# EAGLE schematic Lafferty1ab (EAGLE 6.6.0), part 1 of 2

## Sheet 1 of 5
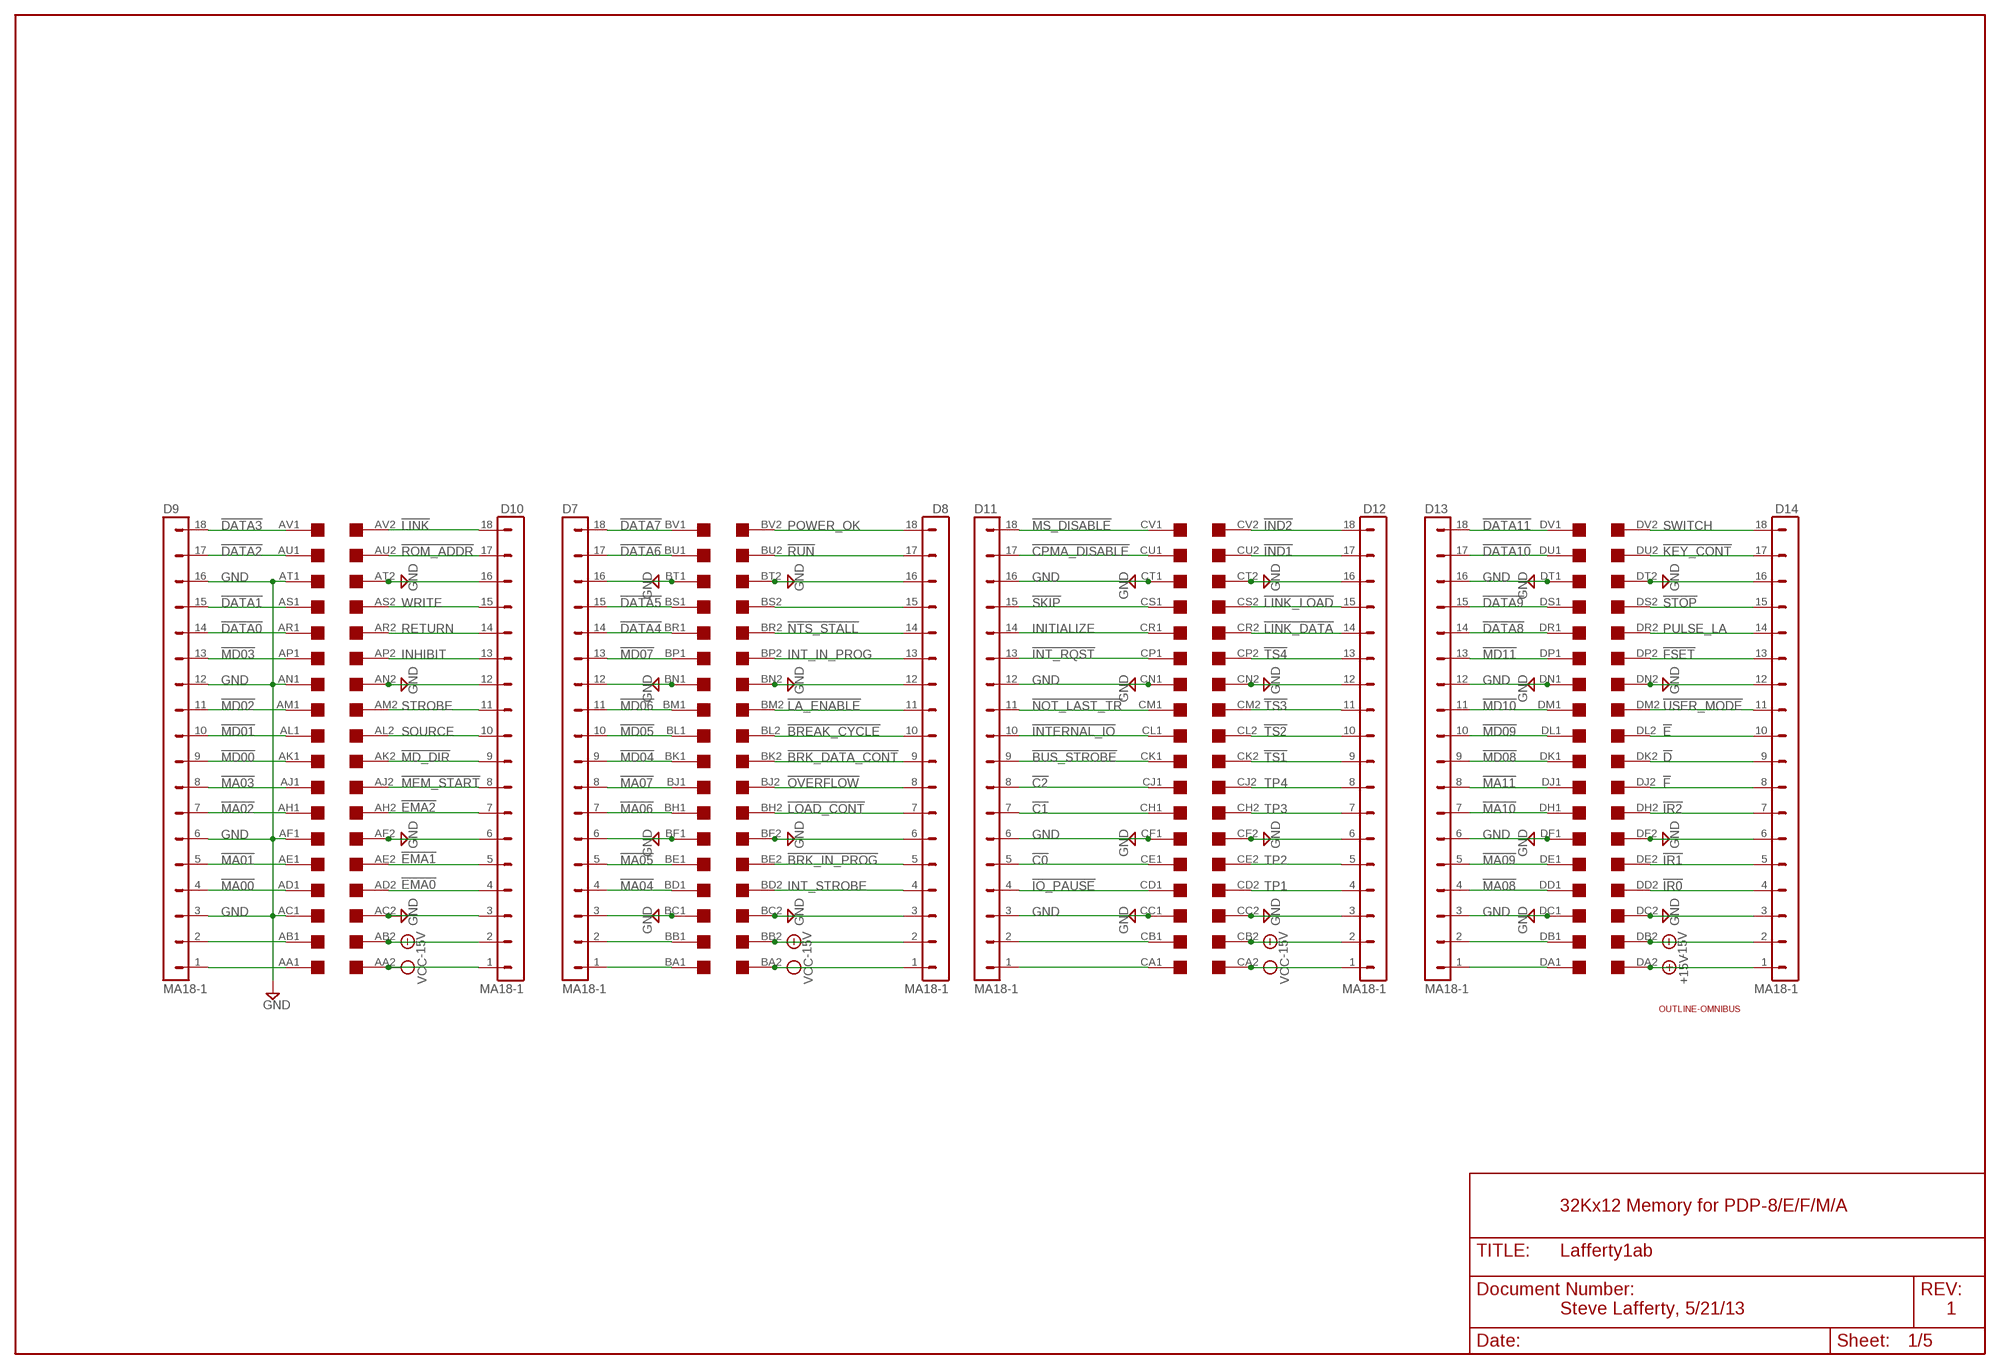
[diagram p0: schematic, sheet 1]

### Parts
D7  MA18-1  [MA18-1]
D8  MA18-1  [MA18-1]
D9  MA18-1  [MA18-1]
D10  MA18-1  [MA18-1]
D11  MA18-1  [MA18-1]
D12  MA18-1  [MA18-1]
D13  MA18-1  [MA18-1]
D14  MA18-1  [MA18-1]
U$1  OUTLINE-OMNIBUS  [OMNIBUS]
U$2  QUAD  [EDGE-CON8]

### Nets
!BREAK_CYCLE: D8.10 U$2.BL2
!BRK_DATA_CONT: D8.9 U$2.BK2
!BRK_IN_PROG: D8.5 U$2.BE2
!BUS_STROBE: D11.9 U$2.CK1
!C0: D11.5 U$2.CE1
!C1: D11.7 U$2.CH1
!C2: D11.8 U$2.CJ1
!CPMA_DISABLE: D11.17 U$2.CU1
!D: D14.9 U$2.DK2
!DATA0: D9.14 U$2.AR1
!DATA1: D9.15 U$2.AS1
!DATA2: D9.17 U$2.AU1
!DATA3: D9.18 U$2.AV1
!DATA4: D7.14 U$2.BR1
!DATA5: D7.15 U$2.BS1
!DATA6: D7.17 U$2.BU1
!DATA7: D7.18 U$2.BV1
!DATA8: D13.14 U$2.DR1
!DATA9: D13.15 U$2.DS1
!DATA10: D13.17 U$2.DU1
!DATA11: D13.18 U$2.DV1
!E: D14.10 U$2.DL2
!EMA0: D10.4 U$2.AD2 ; also sheet 2
!EMA1: D10.5 U$2.AE2 ; also sheet 2
!EMA2: D10.7 U$2.AH2 ; also sheet 2
!F: D14.8 U$2.DJ2
!FSET: D14.13 U$2.DP2
!IND1: D12.17 U$2.CU2
!IND2: D12.18 U$2.CV2
!INT_RQST: D11.13 U$2.CP1
!INTERNAL_IO: D11.10 U$2.CL1
!IO_PAUSE: D11.4 U$2.CD1
!IR0: D14.4 U$2.DD2
!IR1: D14.5 U$2.DE2
!IR2: D14.7 U$2.DH2
!KEY_CONT: D14.17 U$2.DU2
!LA_ENABLE: D8.11 U$2.BM2
!LINK: D10.18 U$2.AV2
!LINK_DATA: D12.14 U$2.CR2
!LINK_LOAD: D12.15 U$2.CS2
!LOAD_CONT: D8.7 U$2.BH2
!MA00: D9.4 U$2.AD1 ; also sheet 2
!MA01: D9.5 U$2.AE1 ; also sheet 2
!MA02: D9.7 U$2.AH1 ; also sheet 2
!MA03: D9.8 U$2.AJ1 ; also sheet 2
!MA04: D7.4 U$2.BD1 ; also sheet 2
!MA05: D7.5 U$2.BE1 ; also sheet 2
!MA06: D7.7 U$2.BH1 ; also sheet 2
!MA07: D7.8 U$2.BJ1 ; also sheet 2
!MA08: D13.4 U$2.DD1 ; also sheet 2
!MA09: D13.5 U$2.DE1 ; also sheet 2
!MA10: D13.7 U$2.DH1 ; also sheet 2
!MA11: D13.8 U$2.DJ1 ; also sheet 2
!MD00: D9.9 U$2.AK1 ; also sheet 2
!MD01: D9.10 U$2.AL1 ; also sheet 2
!MD02: D9.11 U$2.AM1 ; also sheet 2
!MD03: D9.13 U$2.AP1 ; also sheet 2
!MD04: D7.9 U$2.BK1 ; also sheet 2
!MD05: D7.10 U$2.BL1 ; also sheet 2
!MD06: D7.11 U$2.BM1 ; also sheet 2
!MD07: D7.13 U$2.BP1 ; also sheet 2
!MD08: D13.9 U$2.DK1 ; also sheet 2
!MD09: D13.10 U$2.DL1 ; also sheet 2
!MD10: D13.11 U$2.DM1 ; also sheet 2
!MD11: D13.13 U$2.DP1 ; also sheet 2
!MD_DIR: D10.9 U$2.AK2 ; also sheet 2
!MEM_START: D10.8 U$2.AJ2
!MS_DISABLE: D11.18 U$2.CV1
!NOT_LAST_TR: D11.11 U$2.CM1
!NTS_STALL: D8.14 U$2.BR2
!OVERFLOW: D8.8 U$2.BJ2
!ROM_ADDR: D10.17 U$2.AU2 ; also sheet 2
!RUN: D8.17 U$2.BU2
!SKIP: D11.15 U$2.CS1
!STOP: D14.15 U$2.DS2
!TS1: D12.9 U$2.CK2
!TS2: D12.10 U$2.CL2
!TS3: D12.11 U$2.CM2
!TS4: D12.13 U$2.CP2
!USER_MODE: D14.11 U$2.DM2
+15V: D14.1 U$2.DA2
-15V [supply]: D8.2 D10.2 D12.2 D14.2 U$2.AB2 U$2.BB2 U$2.CB2 U$2.DB2
GND [supply]: D7.3 D7.6 D7.12 D7.16 D8.3 D8.6 D8.12 D8.16 D9.3 D9.6 D9.12 D9.16 D10.3 D10.6 D10.12 D10.16 D11.3 D11.6 D11.12 D11.16 D12.3 D12.6 D12.12 D12.16 D13.3 D13.6 D13.12 D13.16 D14.3 D14.6 D14.12 D14.16 U$2.AC1 U$2.AC2 U$2.AF1 U$2.AF2 U$2.AN1 U$2.AN2 U$2.AT1 U$2.AT2 U$2.BC1 U$2.BC2 U$2.BF1 U$2.BF2 U$2.BN1 U$2.BN2 U$2.BT1 U$2.BT2 U$2.CC1 U$2.CC2 U$2.CF1 U$2.CF2 U$2.CN1 U$2.CN2 U$2.CT1 U$2.CT2 U$2.DC1 U$2.DC2 U$2.DF1 U$2.DF2 U$2.DN1 U$2.DN2 U$2.DT1 U$2.DT2 ; also sheet 2,3,4,5
INHIBIT: D10.13 U$2.AP2
INITIALIZE: D11.14 U$2.CR1
INT_IN_PROG: D8.13 U$2.BP2
INT_STROBE: D8.4 U$2.BD2
N$46: D9.2 U$2.AB1
N$47: D9.1 U$2.AA1
N$48: D7.2 U$2.BB1
N$49: D7.1 U$2.BA1
N$50: D11.1 U$2.CA1
N$51: D8.15 U$2.BS2
N$52: D11.2 U$2.CB1
N$53: D13.1 U$2.DA1
N$54: D13.2 U$2.DB1
POWER_OK: D8.18 U$2.BV2 ; also sheet 2
PULSE_LA: D14.14 U$2.DR2
RETURN: D10.14 U$2.AR2
SOURCE: D10.10 U$2.AL2 ; also sheet 2
STROBE: D10.11 U$2.AM2
SWITCH: D14.18 U$2.DV2
TP1: D12.4 U$2.CD2
TP2: D12.5 U$2.CE2
TP3: D12.7 U$2.CH2
TP4: D12.8 U$2.CJ2
VCC [supply]: D8.1 D10.1 D12.1 U$2.AA2 U$2.BA2 U$2.CA2 ; also sheet 2,4,5
WRITE: D10.15 U$2.AS2 ; also sheet 2

### Notes on the sheet
- 32Kx12 Memory for PDP-8/E/F/M/A
- Steve Lafferty, 5/21/13 | 1

## Sheet 2 of 5
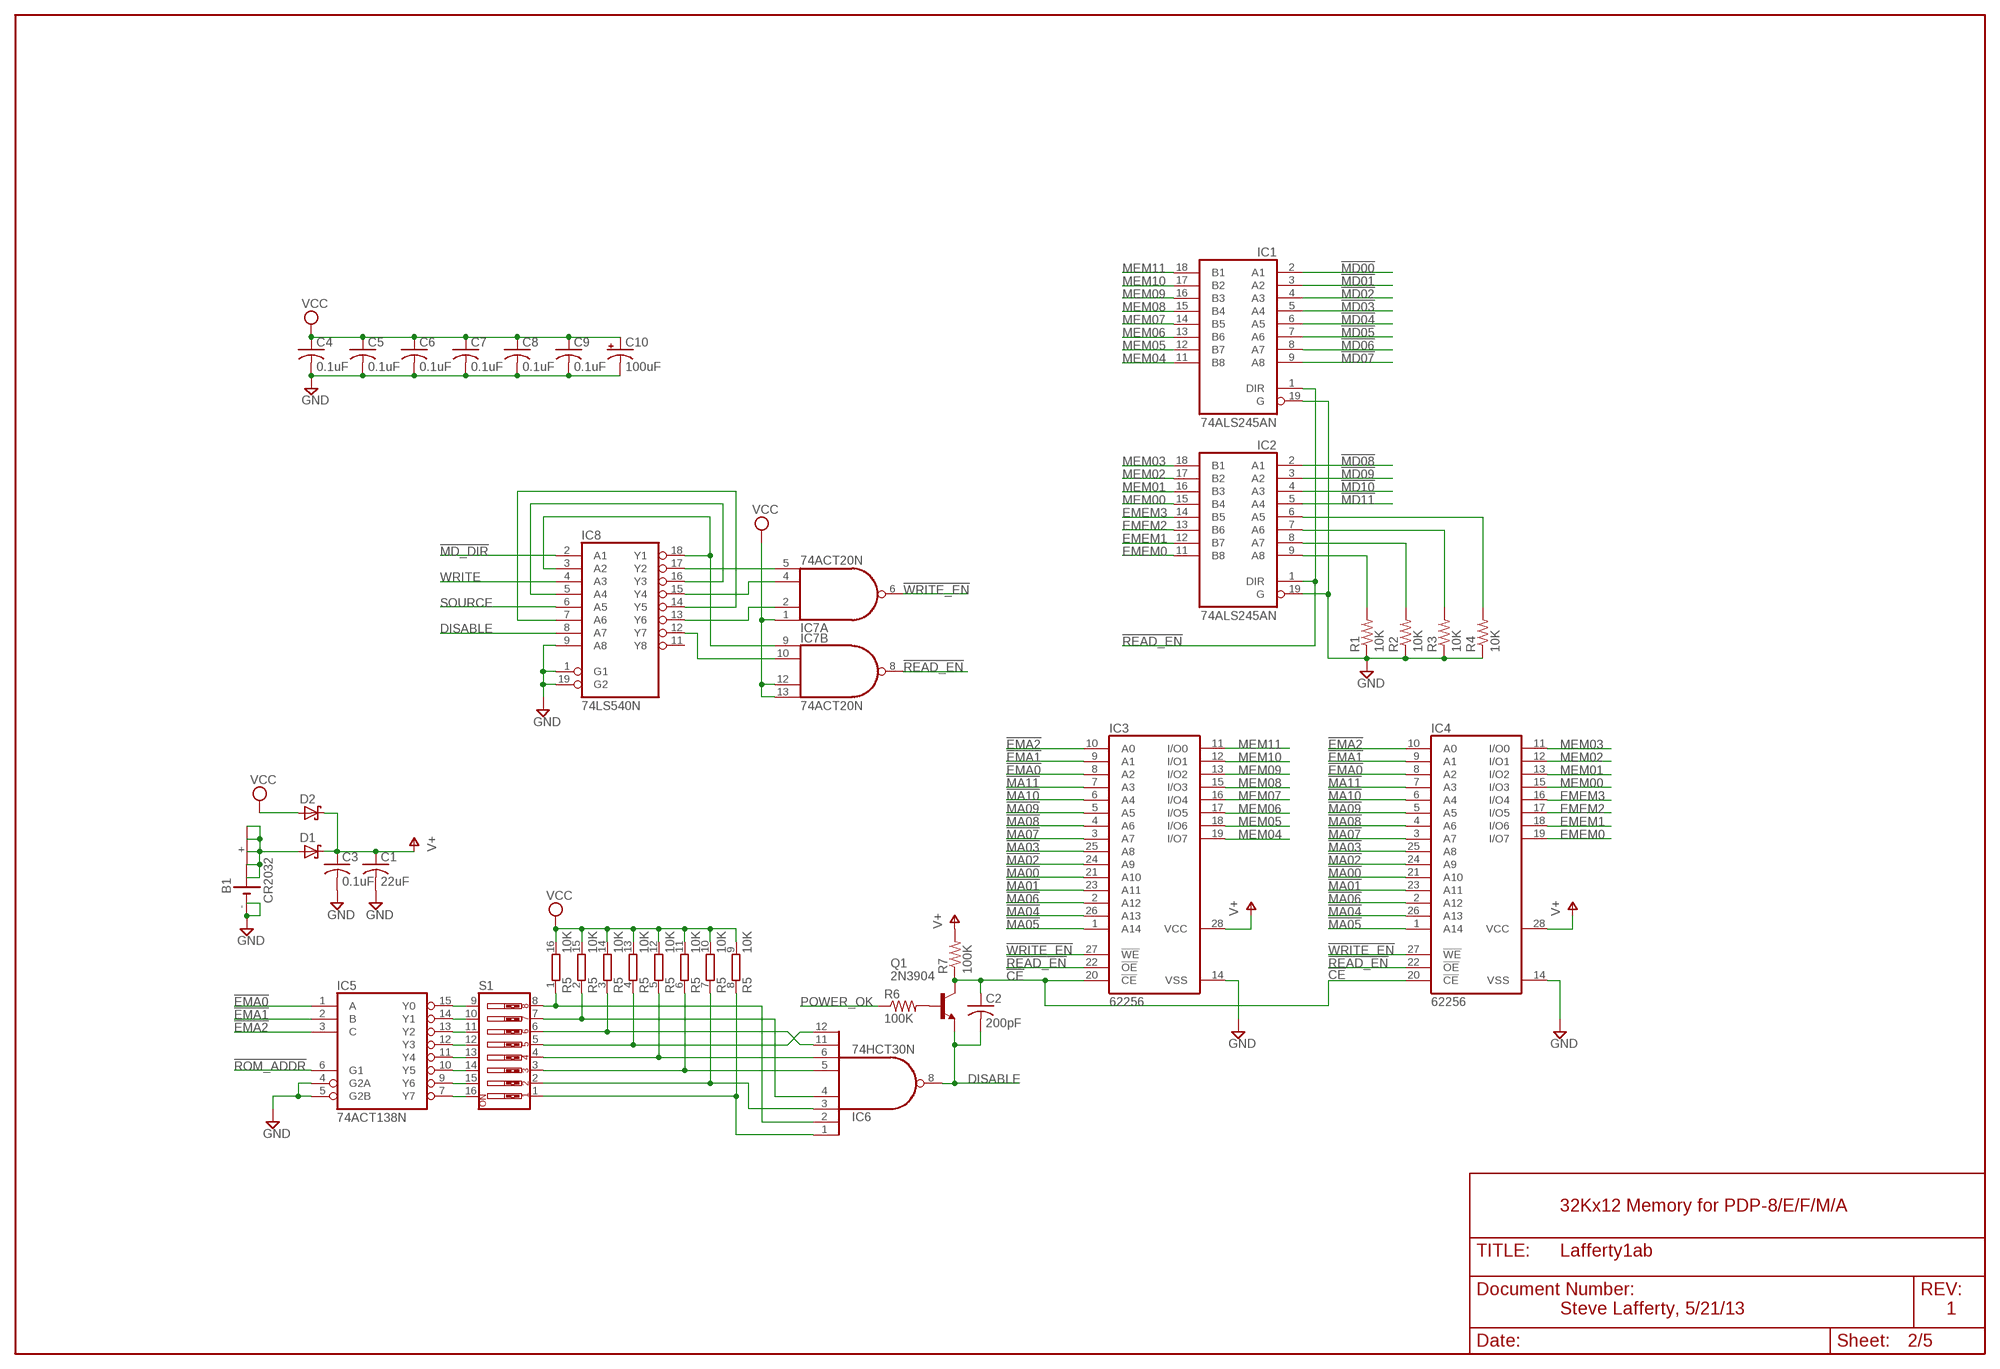
[diagram p1: schematic, sheet 2]

### Parts
B1  CR2032  B2430UNI  [B2430UNI]
C1  22uF  C-US050-025X075  [C050-025X075]
C2  200pF  C-US050-025X075  [C050-025X075]
C3  0.1uF  C-US050-025X075  [C050-025X075]
C4  0.1uF  C-US050-025X075  [C050-025X075]
C5  0.1uF  C-US050-025X075  [C050-025X075]
C6  0.1uF  C-US050-025X075  [C050-025X075]
C7  0.1uF  C-US050-025X075  [C050-025X075]
C8  0.1uF  C-US050-025X075  [C050-025X075]
C9  0.1uF  C-US050-025X075  [C050-025X075]
C10  100uF  CPOL-USE20-8AXIAL  [E12-8]
D1  BAT19  [DO35-10]
D2  BAT19  [DO35-10]
IC1  74ALS245AN  74LS245N  [DIL20]
IC2  74ALS245AN  74LS245N  [DIL20]
IC3  62256  58C256P  [DIL28-6]
IC4  62256  58C256P  [DIL28-6]
IC5  74ACT138N  74LS138N  [DIL16]
IC6  74HCT30N  74LS30N  [DIL14]
IC7  74ACT20N  74LS20N  [DIL14]
IC8  74LS540N  [DIL20]
Q1  2N3904  [TO92]
R1  10K  R-US_0207/10  [0207/10]
R2  10K  R-US_0207/10  [0207/10]
R3  10K  R-US_0207/10  [0207/10]
R4  10K  R-US_0207/10  [0207/10]
R5  10K  8R-P  [DIL16]
R6  100K  R-US_0207/10  [0207/10]
R7  100K  R-US_0207/10  [0207/10]
S1  SW_DIP-8  [EDG-08]

### Nets
!CE: C2.1 IC3.20(!CE) IC4.20(!CE) Q1.1(C) R7.1
!EMA0: IC3.8(A2) IC4.8(A2) IC5.1(A) ; also sheet 1
!EMA1: IC3.9(A1) IC4.9(A1) IC5.2(B) ; also sheet 1
!EMA2: IC3.10(A0) IC4.10(A0) IC5.3(C) ; also sheet 1
!MA00: IC3.21(A10) IC4.21(A10) ; also sheet 1
!MA01: IC3.23(A11) IC4.23(A11) ; also sheet 1
!MA02: IC3.24(A9) IC4.24(A9) ; also sheet 1
!MA03: IC3.25(A8) IC4.25(A8) ; also sheet 1
!MA04: IC3.26(A13) IC4.26(A13) ; also sheet 1
!MA05: IC3.1(A14) IC4.1(A14) ; also sheet 1
!MA06: IC3.2(A12) IC4.2(A12) ; also sheet 1
!MA07: IC3.3(A7) IC4.3(A7) ; also sheet 1
!MA08: IC3.4(A6) IC4.4(A6) ; also sheet 1
!MA09: IC3.5(A5) IC4.5(A5) ; also sheet 1
!MA10: IC3.6(A4) IC4.6(A4) ; also sheet 1
!MA11: IC3.7(A3) IC4.7(A3) ; also sheet 1
!MD00: IC1.2(A1) ; also sheet 1
!MD01: IC1.3(A2) ; also sheet 1
!MD02: IC1.4(A3) ; also sheet 1
!MD03: IC1.5(A4) ; also sheet 1
!MD04: IC1.6(A5) ; also sheet 1
!MD05: IC1.7(A6) ; also sheet 1
!MD06: IC1.8(A7) ; also sheet 1
!MD07: IC1.9(A8) ; also sheet 1
!MD08: IC2.2(A1) ; also sheet 1
!MD09: IC2.3(A2) ; also sheet 1
!MD10: IC2.4(A3) ; also sheet 1
!MD11: IC2.5(A4) ; also sheet 1
!MD_DIR: IC8.2(A1) ; also sheet 1
!READ_EN: IC1.1(DIR) IC2.1(DIR) IC3.22(!OE) IC4.22(!OE) IC7.8(B:O)
!ROM_ADDR: IC5.6(G1) ; also sheet 1
!WRITE_EN: IC3.27(!WE) IC4.27(!WE) IC7.6(A:O)
DISABLE: C2.2 IC6.8(O) IC8.8(A7) Q1.3(E)
EMEM0: IC2.11(B8) IC4.19(I/O7)
EMEM1: IC2.12(B7) IC4.18(I/O6)
EMEM2: IC2.13(B6) IC4.17(I/O5)
EMEM3: IC2.14(B5) IC4.16(I/O4)
GND [supply]: B1.- B1.-@1(-) C1.2 C3.2 C4.2 C5.2 C6.2 C7.2 C8.2 C9.2 C10.- IC1.19(G) IC2.19(G) IC3.14(VSS) IC4.14(VSS) IC5.4(G2A) IC5.5(G2B) IC8.1(G1) IC8.9(A8) IC8.19(G2) R1.1 R2.1 R3.1 R4.1 ; also sheet 1,3,4,5
MEM00: IC2.15(B4) IC4.15(I/O3)
MEM01: IC2.16(B3) IC4.13(I/O2)
MEM02: IC2.17(B2) IC4.12(I/O1)
MEM03: IC2.18(B1) IC4.11(I/O0)
MEM04: IC1.11(B8) IC3.19(I/O7)
MEM05: IC1.12(B7) IC3.18(I/O6)
MEM06: IC1.13(B6) IC3.17(I/O5)
MEM07: IC1.14(B5) IC3.16(I/O4)
MEM08: IC1.15(B4) IC3.15(I/O3)
MEM09: IC1.16(B3) IC3.13(I/O2)
MEM10: IC1.17(B2) IC3.12(I/O1)
MEM11: IC1.18(B1) IC3.11(I/O0)
N$1: IC5.7(Y7) S1.16
N$18: IC5.9(Y6) S1.15
N$19: IC5.10(Y5) S1.14
N$20: IC5.11(Y4) S1.13
N$21: IC5.12(Y3) S1.12
N$22: IC5.13(Y2) S1.11
N$23: IC5.14(Y1) S1.10
N$24: IC5.15(Y0) S1.9
N$25: B1.+ B1.+@1(+) B1.+@2(+) B1.+@3(+) B1.+@4(+) D1.A
N$26: IC6.12(I7) R5.4 S1.5
N$27: IC6.11(I6) R5.3 S1.6
N$28: IC6.6(I5) R5.5 S1.4
N$29: IC6.5(I4) R5.6 S1.3
N$30: IC6.3(I2) R5.7 S1.2
N$31: IC6.1(I0) R5.8 S1.1
N$32: IC6.2(I1) R5.1 S1.8
N$33: IC6.4(I3) R5.2 S1.7
N$34: IC7.5(A:I3) IC8.17(Y2)
N$35: IC2.6(A5) R4.2
N$36: Q1.2(B) R6.2
N$37: IC2.7(A6) R3.2
N$38: IC2.8(A7) R2.2
N$39: IC2.9(A8) R1.2
N$40: IC8.5(A4) IC8.16(Y3)
N$41: IC7.9(B:I0) IC8.3(A2) IC8.18(Y1)
N$42: IC8.7(A6) IC8.14(Y5)
N$43: IC7.2(A:I1) IC8.13(Y6)
N$44: IC7.4(A:I2) IC8.15(Y4)
N$45: IC7.10(B:I1) IC8.12(Y7)
POWER_OK: R6.1 ; also sheet 1
SOURCE: IC8.6(A5) ; also sheet 1
V+: C1.1 C3.1 D1.C D2.C IC3.28(VCC) IC4.28(VCC) R7.2
VCC [supply]: C4.1 C5.1 C6.1 C7.1 C8.1 C9.1 C10.+ D2.A IC7.1(A:I0) IC7.12(B:I2) IC7.13(B:I3) R5.9 R5.10 R5.11 R5.12 R5.13 R5.14 R5.15 R5.16 ; also sheet 1,4,5
WRITE: IC8.4(A3) ; also sheet 1
Unconnected: IC8.11(Y8)

### Notes on the sheet
- 32Kx12 Memory for PDP-8/E/F/M/A
- Steve Lafferty, 5/21/13 | 1

## Sheet 3 of 5
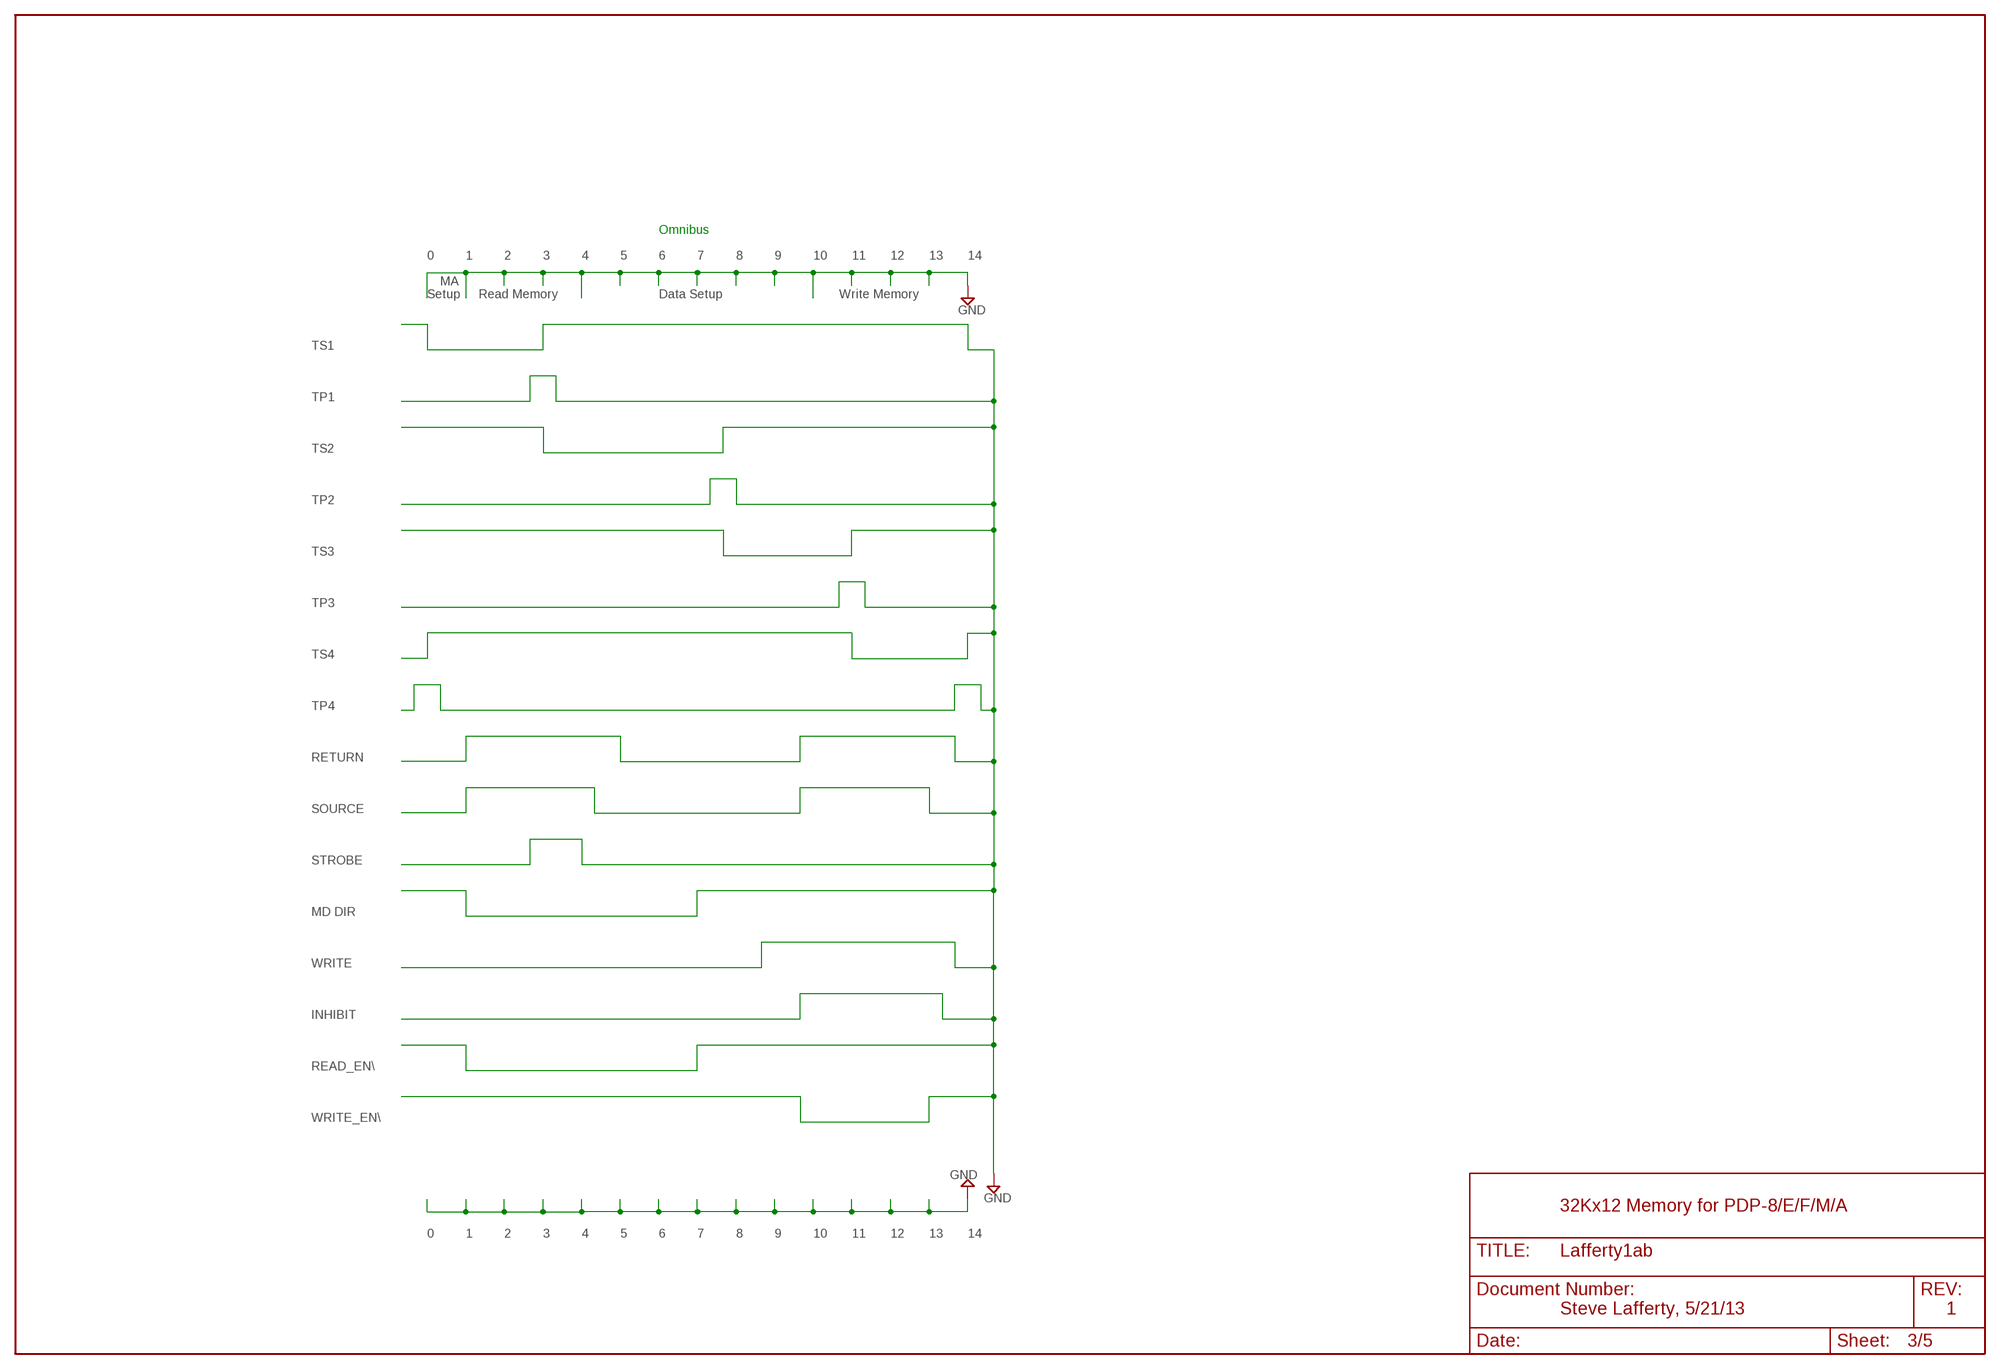
[diagram p2: schematic, sheet 3]

### Notes on the sheet
- Omnibus
- 0 | 1 | 2 | 3 | 4 | 5 | 6 | 7 | 8 | 9 | 10 | 11 | 12 | 13 | 14
- MA
- Setup | Read Memory | Data Setup | Write Memory
- TS1
- TP1
- TS2
- TP2
- TS3
- TP3
- TS4
- TP4
- RETURN
- SOURCE
- STROBE
- MD DIR
- WRITE
- INHIBIT
- READ_EN\\
- WRITE_EN\\
- 32Kx12 Memory for PDP-8/E/F/M/A
- 0 | 1 | 2 | 3 | 4 | 5 | 6 | 7 | 8 | 9 | 10 | 11 | 12 | 13 | 14
- Steve Lafferty, 5/21/13 | 1

## Sheet 4 of 5
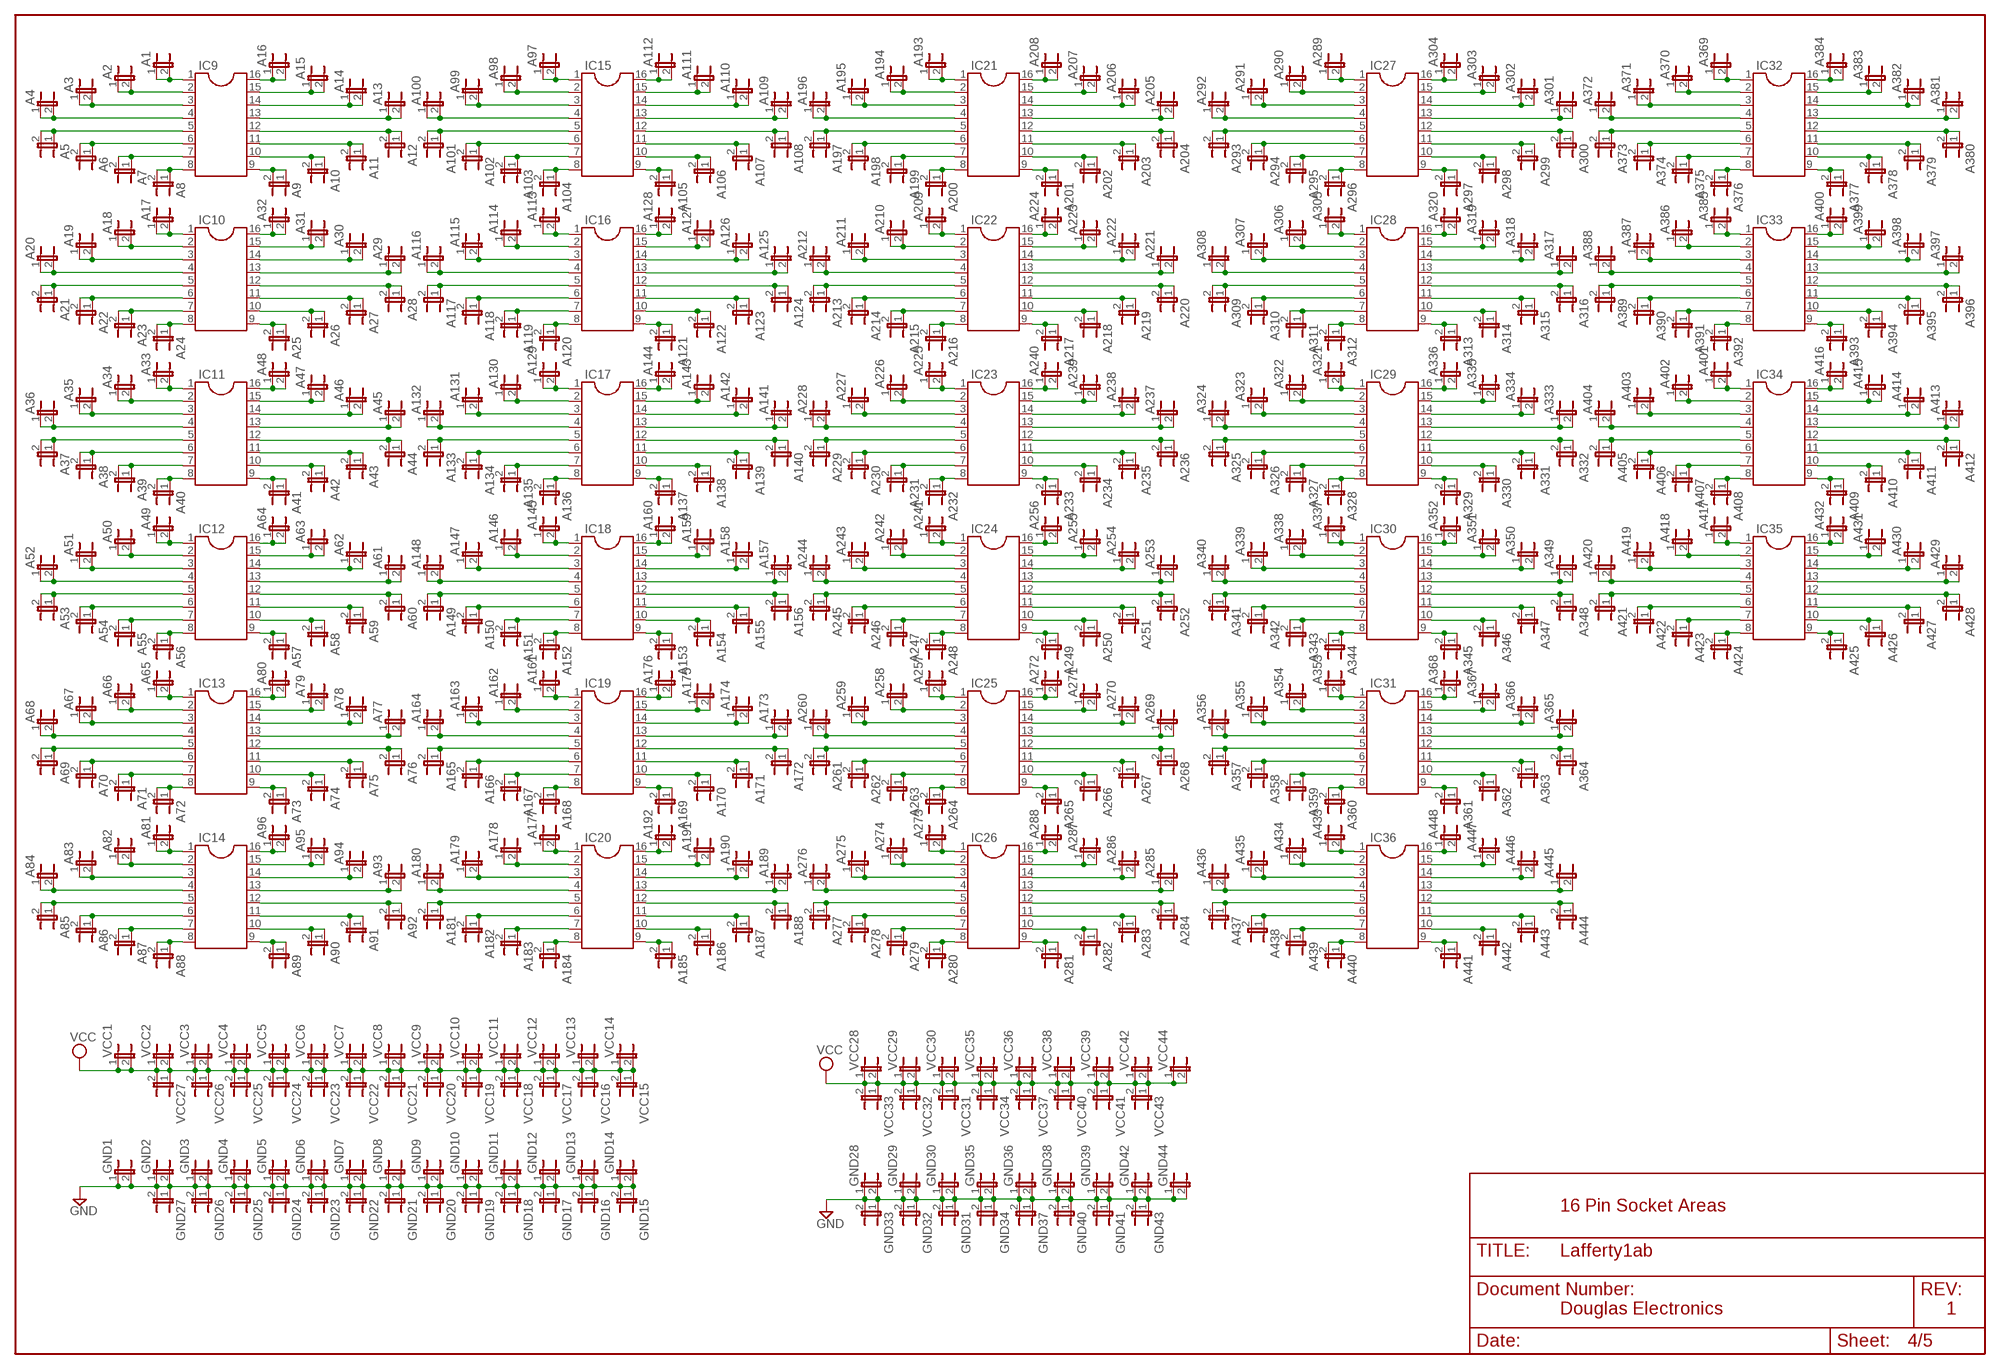
[diagram p3: schematic, sheet 4]

### Parts
A1  JP1E  [JP1]
A2  JP1E  [JP1]
A3  JP1E  [JP1]
A4  JP1E  [JP1]
A5  JP1E  [JP1]
A6  JP1E  [JP1]
A7  JP1E  [JP1]
A8  JP1E  [JP1]
A9  JP1E  [JP1]
A10  JP1E  [JP1]
A11  JP1E  [JP1]
A12  JP1E  [JP1]
A13  JP1E  [JP1]
A14  JP1E  [JP1]
A15  JP1E  [JP1]
A16  JP1E  [JP1]
A17  JP1E  [JP1]
A18  JP1E  [JP1]
A19  JP1E  [JP1]
A20  JP1E  [JP1]
A21  JP1E  [JP1]
A22  JP1E  [JP1]
A23  JP1E  [JP1]
A24  JP1E  [JP1]
A25  JP1E  [JP1]
A26  JP1E  [JP1]
A27  JP1E  [JP1]
A28  JP1E  [JP1]
A29  JP1E  [JP1]
A30  JP1E  [JP1]
A31  JP1E  [JP1]
A32  JP1E  [JP1]
A33  JP1E  [JP1]
A34  JP1E  [JP1]
A35  JP1E  [JP1]
A36  JP1E  [JP1]
A37  JP1E  [JP1]
A38  JP1E  [JP1]
A39  JP1E  [JP1]
A40  JP1E  [JP1]
A41  JP1E  [JP1]
A42  JP1E  [JP1]
A43  JP1E  [JP1]
A44  JP1E  [JP1]
A45  JP1E  [JP1]
A46  JP1E  [JP1]
A47  JP1E  [JP1]
A48  JP1E  [JP1]
A49  JP1E  [JP1]
A50  JP1E  [JP1]
A51  JP1E  [JP1]
A52  JP1E  [JP1]
A53  JP1E  [JP1]
A54  JP1E  [JP1]
A55  JP1E  [JP1]
A56  JP1E  [JP1]
A57  JP1E  [JP1]
A58  JP1E  [JP1]
A59  JP1E  [JP1]
A60  JP1E  [JP1]
A61  JP1E  [JP1]
A62  JP1E  [JP1]
A63  JP1E  [JP1]
A64  JP1E  [JP1]
A65  JP1E  [JP1]
A66  JP1E  [JP1]
A67  JP1E  [JP1]
A68  JP1E  [JP1]
A69  JP1E  [JP1]
A70  JP1E  [JP1]
A71  JP1E  [JP1]
A72  JP1E  [JP1]
A73  JP1E  [JP1]
A74  JP1E  [JP1]
A75  JP1E  [JP1]
A76  JP1E  [JP1]
A77  JP1E  [JP1]
A78  JP1E  [JP1]
A79  JP1E  [JP1]
A80  JP1E  [JP1]
A81  JP1E  [JP1]
A82  JP1E  [JP1]
A83  JP1E  [JP1]
A84  JP1E  [JP1]
A85  JP1E  [JP1]
A86  JP1E  [JP1]
A87  JP1E  [JP1]
A88  JP1E  [JP1]
A89  JP1E  [JP1]
A90  JP1E  [JP1]
A91  JP1E  [JP1]
A92  JP1E  [JP1]
A93  JP1E  [JP1]
A94  JP1E  [JP1]
A95  JP1E  [JP1]
A96  JP1E  [JP1]
A97  JP1E  [JP1]
A98  JP1E  [JP1]
A99  JP1E  [JP1]
A100  JP1E  [JP1]
A101  JP1E  [JP1]
A102  JP1E  [JP1]
A103  JP1E  [JP1]
A104  JP1E  [JP1]
A105  JP1E  [JP1]
A106  JP1E  [JP1]
A107  JP1E  [JP1]
A108  JP1E  [JP1]
A109  JP1E  [JP1]
A110  JP1E  [JP1]
A111  JP1E  [JP1]
A112  JP1E  [JP1]
A113  JP1E  [JP1]
A114  JP1E  [JP1]
A115  JP1E  [JP1]
A116  JP1E  [JP1]
A117  JP1E  [JP1]
A118  JP1E  [JP1]
A119  JP1E  [JP1]
A120  JP1E  [JP1]
A121  JP1E  [JP1]
A122  JP1E  [JP1]
A123  JP1E  [JP1]
A124  JP1E  [JP1]
A125  JP1E  [JP1]
A126  JP1E  [JP1]
A127  JP1E  [JP1]
A128  JP1E  [JP1]
A129  JP1E  [JP1]
A130  JP1E  [JP1]
A131  JP1E  [JP1]
A132  JP1E  [JP1]
A133  JP1E  [JP1]
A134  JP1E  [JP1]
A135  JP1E  [JP1]
A136  JP1E  [JP1]
A137  JP1E  [JP1]
A138  JP1E  [JP1]
A139  JP1E  [JP1]
A140  JP1E  [JP1]
A141  JP1E  [JP1]
A142  JP1E  [JP1]
A143  JP1E  [JP1]
A144  JP1E  [JP1]
A145  JP1E  [JP1]
A146  JP1E  [JP1]
A147  JP1E  [JP1]
A148  JP1E  [JP1]
A149  JP1E  [JP1]
A150  JP1E  [JP1]
A151  JP1E  [JP1]
A152  JP1E  [JP1]
A153  JP1E  [JP1]
A154  JP1E  [JP1]
A155  JP1E  [JP1]
A156  JP1E  [JP1]
A157  JP1E  [JP1]
A158  JP1E  [JP1]
A159  JP1E  [JP1]
A160  JP1E  [JP1]
A161  JP1E  [JP1]
A162  JP1E  [JP1]
A163  JP1E  [JP1]
A164  JP1E  [JP1]
A165  JP1E  [JP1]
A166  JP1E  [JP1]
A167  JP1E  [JP1]
A168  JP1E  [JP1]
A169  JP1E  [JP1]
A170  JP1E  [JP1]
A171  JP1E  [JP1]
A172  JP1E  [JP1]
A173  JP1E  [JP1]
A174  JP1E  [JP1]
A175  JP1E  [JP1]
A176  JP1E  [JP1]
A177  JP1E  [JP1]
A178  JP1E  [JP1]
A179  JP1E  [JP1]
A180  JP1E  [JP1]
A181  JP1E  [JP1]
A182  JP1E  [JP1]
A183  JP1E  [JP1]
A184  JP1E  [JP1]
A185  JP1E  [JP1]
A186  JP1E  [JP1]
A187  JP1E  [JP1]
A188  JP1E  [JP1]
A189  JP1E  [JP1]
A190  JP1E  [JP1]
A191  JP1E  [JP1]
A192  JP1E  [JP1]
A193  JP1E  [JP1]
A194  JP1E  [JP1]
A195  JP1E  [JP1]
A196  JP1E  [JP1]
A197  JP1E  [JP1]
A198  JP1E  [JP1]
A199  JP1E  [JP1]
A200  JP1E  [JP1]
A201  JP1E  [JP1]
A202  JP1E  [JP1]
A203  JP1E  [JP1]
A204  JP1E  [JP1]
A205  JP1E  [JP1]
A206  JP1E  [JP1]
A207  JP1E  [JP1]
A208  JP1E  [JP1]
A209  JP1E  [JP1]
A210  JP1E  [JP1]
A211  JP1E  [JP1]
A212  JP1E  [JP1]
A213  JP1E  [JP1]
A214  JP1E  [JP1]
A215  JP1E  [JP1]
A216  JP1E  [JP1]
A217  JP1E  [JP1]
A218  JP1E  [JP1]
A219  JP1E  [JP1]
A220  JP1E  [JP1]
A221  JP1E  [JP1]
A222  JP1E  [JP1]
A223  JP1E  [JP1]
A224  JP1E  [JP1]
A225  JP1E  [JP1]
A226  JP1E  [JP1]
A227  JP1E  [JP1]
A228  JP1E  [JP1]
A229  JP1E  [JP1]
A230  JP1E  [JP1]
A231  JP1E  [JP1]
A232  JP1E  [JP1]
A233  JP1E  [JP1]
A234  JP1E  [JP1]
A235  JP1E  [JP1]
A236  JP1E  [JP1]
A237  JP1E  [JP1]
A238  JP1E  [JP1]
A239  JP1E  [JP1]
A240  JP1E  [JP1]
A241  JP1E  [JP1]
A242  JP1E  [JP1]
A243  JP1E  [JP1]
A244  JP1E  [JP1]
A245  JP1E  [JP1]
A246  JP1E  [JP1]
A247  JP1E  [JP1]
A248  JP1E  [JP1]
A249  JP1E  [JP1]
A250  JP1E  [JP1]
A251  JP1E  [JP1]
A252  JP1E  [JP1]
A253  JP1E  [JP1]
A254  JP1E  [JP1]
A255  JP1E  [JP1]
A256  JP1E  [JP1]
A257  JP1E  [JP1]
A258  JP1E  [JP1]
A259  JP1E  [JP1]
A260  JP1E  [JP1]
A261  JP1E  [JP1]
A262  JP1E  [JP1]
A263  JP1E  [JP1]
A264  JP1E  [JP1]
A265  JP1E  [JP1]
A266  JP1E  [JP1]
A267  JP1E  [JP1]
A268  JP1E  [JP1]
A269  JP1E  [JP1]
A270  JP1E  [JP1]
A271  JP1E  [JP1]
A272  JP1E  [JP1]
A273  JP1E  [JP1]
A274  JP1E  [JP1]
A275  JP1E  [JP1]
A276  JP1E  [JP1]
A277  JP1E  [JP1]
A278  JP1E  [JP1]
A279  JP1E  [JP1]
A280  JP1E  [JP1]
A281  JP1E  [JP1]
A282  JP1E  [JP1]
A283  JP1E  [JP1]
A284  JP1E  [JP1]
A285  JP1E  [JP1]
A286  JP1E  [JP1]
A287  JP1E  [JP1]
A288  JP1E  [JP1]
A289  JP1E  [JP1]
A290  JP1E  [JP1]
A291  JP1E  [JP1]
A292  JP1E  [JP1]
A293  JP1E  [JP1]
A294  JP1E  [JP1]
A295  JP1E  [JP1]
A296  JP1E  [JP1]
A297  JP1E  [JP1]
A298  JP1E  [JP1]
A299  JP1E  [JP1]
A300  JP1E  [JP1]
A301  JP1E  [JP1]
A302  JP1E  [JP1]
A303  JP1E  [JP1]
A304  JP1E  [JP1]
A305  JP1E  [JP1]
A306  JP1E  [JP1]
A307  JP1E  [JP1]
A308  JP1E  [JP1]
A309  JP1E  [JP1]
A310  JP1E  [JP1]
A311  JP1E  [JP1]
A312  JP1E  [JP1]
A313  JP1E  [JP1]
A314  JP1E  [JP1]
A315  JP1E  [JP1]
A316  JP1E  [JP1]
A317  JP1E  [JP1]
A318  JP1E  [JP1]
A319  JP1E  [JP1]
A320  JP1E  [JP1]
A321  JP1E  [JP1]
A322  JP1E  [JP1]
A323  JP1E  [JP1]
A324  JP1E  [JP1]
A325  JP1E  [JP1]
A326  JP1E  [JP1]
A327  JP1E  [JP1]
A328  JP1E  [JP1]
A329  JP1E  [JP1]
A330  JP1E  [JP1]
A331  JP1E  [JP1]
A332  JP1E  [JP1]
A333  JP1E  [JP1]
A334  JP1E  [JP1]
A335  JP1E  [JP1]
A336  JP1E  [JP1]
A337  JP1E  [JP1]
A338  JP1E  [JP1]
A339  JP1E  [JP1]
A340  JP1E  [JP1]
A341  JP1E  [JP1]
A342  JP1E  [JP1]
A343  JP1E  [JP1]
A344  JP1E  [JP1]
A345  JP1E  [JP1]
A346  JP1E  [JP1]
A347  JP1E  [JP1]
A348  JP1E  [JP1]
A349  JP1E  [JP1]
A350  JP1E  [JP1]
A351  JP1E  [JP1]
A352  JP1E  [JP1]
A353  JP1E  [JP1]
A354  JP1E  [JP1]
A355  JP1E  [JP1]
A356  JP1E  [JP1]
A357  JP1E  [JP1]
A358  JP1E  [JP1]
A359  JP1E  [JP1]
A360  JP1E  [JP1]
A361  JP1E  [JP1]
A362  JP1E  [JP1]
A363  JP1E  [JP1]
A364  JP1E  [JP1]
A365  JP1E  [JP1]
A366  JP1E  [JP1]
A367  JP1E  [JP1]
A368  JP1E  [JP1]
A369  JP1E  [JP1]
A370  JP1E  [JP1]
A371  JP1E  [JP1]
A372  JP1E  [JP1]
A373  JP1E  [JP1]
A374  JP1E  [JP1]
A375  JP1E  [JP1]
A376  JP1E  [JP1]
A377  JP1E  [JP1]
A378  JP1E  [JP1]
A379  JP1E  [JP1]
A380  JP1E  [JP1]
A381  JP1E  [JP1]
A382  JP1E  [JP1]
A383  JP1E  [JP1]
A384  JP1E  [JP1]
A385  JP1E  [JP1]
A386  JP1E  [JP1]
A387  JP1E  [JP1]
A388  JP1E  [JP1]
A389  JP1E  [JP1]
A390  JP1E  [JP1]
A391  JP1E  [JP1]
A392  JP1E  [JP1]
A393  JP1E  [JP1]
A394  JP1E  [JP1]
A395  JP1E  [JP1]
A396  JP1E  [JP1]
A397  JP1E  [JP1]
A398  JP1E  [JP1]
A399  JP1E  [JP1]
A400  JP1E  [JP1]
A401  JP1E  [JP1]
A402  JP1E  [JP1]
A403  JP1E  [JP1]
A404  JP1E  [JP1]
A405  JP1E  [JP1]
A406  JP1E  [JP1]
A407  JP1E  [JP1]
A408  JP1E  [JP1]
A409  JP1E  [JP1]
A410  JP1E  [JP1]
A411  JP1E  [JP1]
A412  JP1E  [JP1]
A413  JP1E  [JP1]
A414  JP1E  [JP1]
A415  JP1E  [JP1]
A416  JP1E  [JP1]
A417  JP1E  [JP1]
A418  JP1E  [JP1]
A419  JP1E  [JP1]
A420  JP1E  [JP1]
A421  JP1E  [JP1]
A422  JP1E  [JP1]
A423  JP1E  [JP1]
A424  JP1E  [JP1]
A425  JP1E  [JP1]
A426  JP1E  [JP1]
A427  JP1E  [JP1]
A428  JP1E  [JP1]
A429  JP1E  [JP1]
A430  JP1E  [JP1]
A431  JP1E  [JP1]
A432  JP1E  [JP1]
A433  JP1E  [JP1]
A434  JP1E  [JP1]
A435  JP1E  [JP1]
A436  JP1E  [JP1]
A437  JP1E  [JP1]
A438  JP1E  [JP1]
A439  JP1E  [JP1]
A440  JP1E  [JP1]
A441  JP1E  [JP1]
A442  JP1E  [JP1]
A443  JP1E  [JP1]
A444  JP1E  [JP1]
A445  JP1E  [JP1]
A446  JP1E  [JP1]
A447  JP1E  [JP1]
A448  JP1E  [JP1]
GND1  JP1E  [JP1]
GND2  JP1E  [JP1]
GND3  JP1E  [JP1]
GND4  JP1E  [JP1]
GND5  JP1E  [JP1]
GND6  JP1E  [JP1]
GND7  JP1E  [JP1]
GND8  JP1E  [JP1]
GND9  JP1E  [JP1]
GND10  JP1E  [JP1]
GND11  JP1E  [JP1]
GND12  JP1E  [JP1]
GND13  JP1E  [JP1]
GND14  JP1E  [JP1]
GND15  JP1E  [JP1]
GND16  JP1E  [JP1]
GND17  JP1E  [JP1]
GND18  JP1E  [JP1]
GND19  JP1E  [JP1]
GND20  JP1E  [JP1]
GND21  JP1E  [JP1]
GND22  JP1E  [JP1]
GND23  JP1E  [JP1]
GND24  JP1E  [JP1]
GND25  JP1E  [JP1]
GND26  JP1E  [JP1]
GND27  JP1E  [JP1]
GND28  JP1E  [JP1]
GND29  JP1E  [JP1]
GND30  JP1E  [JP1]
GND31  JP1E  [JP1]
GND32  JP1E  [JP1]
GND33  JP1E  [JP1]
GND34  JP1E  [JP1]
GND35  JP1E  [JP1]
GND36  JP1E  [JP1]
GND37  JP1E  [JP1]
GND38  JP1E  [JP1]
GND39  JP1E  [JP1]
GND40  JP1E  [JP1]
GND41  JP1E  [JP1]
GND42  JP1E  [JP1]
GND43  JP1E  [JP1]
GND44  JP1E  [JP1]
IC9  DIL16  [DIL16]
IC10  DIL16  [DIL16]
IC11  DIL16  [DIL16]
IC12  DIL16  [DIL16]
IC13  DIL16  [DIL16]
IC14  DIL16  [DIL16]
IC15  DIL16  [DIL16]
IC16  DIL16  [DIL16]
IC17  DIL16  [DIL16]
IC18  DIL16  [DIL16]
IC19  DIL16  [DIL16]
IC20  DIL16  [DIL16]
IC21  DIL16  [DIL16]
IC22  DIL16  [DIL16]
IC23  DIL16  [DIL16]
IC24  DIL16  [DIL16]
IC25  DIL16  [DIL16]
IC26  DIL16  [DIL16]
IC27  DIL16  [DIL16]
IC28  DIL16  [DIL16]
IC29  DIL16  [DIL16]
IC30  DIL16  [DIL16]
IC31  DIL16  [DIL16]
IC32  DIL16  [DIL16]
IC33  DIL16  [DIL16]
IC34  DIL16  [DIL16]
IC35  DIL16  [DIL16]
IC36  DIL16  [DIL16]
VCC1  JP1E  [JP1]
VCC2  JP1E  [JP1]
VCC3  JP1E  [JP1]
VCC4  JP1E  [JP1]
VCC5  JP1E  [JP1]
VCC6  JP1E  [JP1]
VCC7  JP1E  [JP1]
VCC8  JP1E  [JP1]
VCC9  JP1E  [JP1]
VCC10  JP1E  [JP1]
VCC11  JP1E  [JP1]
VCC12  JP1E  [JP1]
VCC13  JP1E  [JP1]
VCC14  JP1E  [JP1]
VCC15  JP1E  [JP1]
VCC16  JP1E  [JP1]
VCC17  JP1E  [JP1]
VCC18  JP1E  [JP1]
VCC19  JP1E  [JP1]
VCC20  JP1E  [JP1]
VCC21  JP1E  [JP1]
VCC22  JP1E  [JP1]
VCC23  JP1E  [JP1]
VCC24  JP1E  [JP1]
VCC25  JP1E  [JP1]
VCC26  JP1E  [JP1]
VCC27  JP1E  [JP1]
VCC28  JP1E  [JP1]
VCC29  JP1E  [JP1]
VCC30  JP1E  [JP1]
VCC31  JP1E  [JP1]
VCC32  JP1E  [JP1]
VCC33  JP1E  [JP1]
VCC34  JP1E  [JP1]
VCC35  JP1E  [JP1]
VCC36  JP1E  [JP1]
VCC37  JP1E  [JP1]
VCC38  JP1E  [JP1]
VCC39  JP1E  [JP1]
VCC40  JP1E  [JP1]
VCC41  JP1E  [JP1]
VCC42  JP1E  [JP1]
VCC43  JP1E  [JP1]
VCC44  JP1E  [JP1]

### Nets
GND [supply]: GND1.1 GND1.2 GND2.1 GND2.2 GND3.1 GND3.2 GND4.1 GND4.2 GND5.1 GND5.2 GND6.1 GND6.2 GND7.1 GND7.2 GND8.1 GND8.2 GND9.1 GND9.2 GND10.1 GND10.2 GND11.1 GND11.2 GND12.1 GND12.2 GND13.1 GND13.2 GND14.1 GND14.2 GND15.1 GND15.2 GND16.1 GND16.2 GND17.1 GND17.2 GND18.1 GND18.2 GND19.1 GND19.2 GND20.1 GND20.2 GND21.1 GND21.2 GND22.1 GND22.2 GND23.1 GND23.2 GND24.1 GND24.2 GND25.1 GND25.2 GND26.1 GND26.2 GND27.1 GND27.2 GND28.1 GND28.2 GND29.1 GND29.2 GND30.1 GND30.2 GND31.1 GND31.2 GND32.1 GND32.2 GND33.1 GND33.2 GND34.1 GND34.2 GND35.1 GND35.2 GND36.1 GND36.2 GND37.1 GND37.2 GND38.1 GND38.2 GND39.1 GND39.2 GND40.1 GND40.2 GND41.1 GND41.2 GND42.1 GND42.2 GND43.1 GND43.2 GND44.1 GND44.2 ; also sheet 1,2,3,5
N$55: A16.1 A16.2 IC9.16
N$56: A14.1 A14.2 IC9.14
N$57: A9.1 A9.2 IC9.9
N$58: A15.1 A15.2 IC9.15
N$59: A10.1 A10.2 IC9.10
N$60: A13.1 A13.2 IC9.13
N$61: A32.1 A32.2 IC10.16
N$62: A12.1 A12.2 IC9.12
N$63: A11.1 A11.2 IC9.11
N$64: A1.1 A1.2 IC9.1
N$65: A8.1 A8.2 IC9.8
N$66: A2.1 A2.2 IC9.2
N$67: A7.1 A7.2 IC9.7
N$68: A3.1 A3.2 IC9.3
N$69: A4.1 A4.2 IC9.4
N$70: A5.1 A5.2 IC9.5
N$71: A6.1 A6.2 IC9.6
N$72: A25.1 A25.2 IC10.9
N$73: A31.1 A31.2 IC10.15
N$74: A26.1 A26.2 IC10.10
N$75: A30.1 A30.2 IC10.14
N$76: A29.1 A29.2 IC10.13
N$77: A28.1 A28.2 IC10.12
N$78: A27.1 A27.2 IC10.11
N$79: A17.1 A17.2 IC10.1
N$80: A24.1 A24.2 IC10.8
N$81: A18.1 A18.2 IC10.2
N$82: A23.1 A23.2 IC10.7
N$83: A19.1 A19.2 IC10.3
N$84: A20.1 A20.2 IC10.4
N$85: A21.1 A21.2 IC10.5
N$86: A22.1 A22.2 IC10.6
N$87: A48.1 A48.2 IC11.16
N$88: A41.1 A41.2 IC11.9
N$89: A47.1 A47.2 IC11.15
N$90: A42.1 A42.2 IC11.10
N$91: A46.1 A46.2 IC11.14
N$92: A45.1 A45.2 IC11.13
N$93: A44.1 A44.2 IC11.12
N$94: A43.1 A43.2 IC11.11
N$95: A33.1 A33.2 IC11.1
N$96: A40.1 A40.2 IC11.8
N$97: A34.1 A34.2 IC11.2
N$98: A39.1 A39.2 IC11.7
N$99: A35.1 A35.2 IC11.3
N$100: A36.1 A36.2 IC11.4
N$101: A37.1 A37.2 IC11.5
N$102: A38.1 A38.2 IC11.6
N$103: A64.1 A64.2 IC12.16
N$104: A57.1 A57.2 IC12.9
N$105: A63.1 A63.2 IC12.15
N$106: A58.1 A58.2 IC12.10
N$107: A62.1 A62.2 IC12.14
N$108: A61.1 A61.2 IC12.13
N$109: A60.1 A60.2 IC12.12
N$110: A59.1 A59.2 IC12.11
N$111: A49.1 A49.2 IC12.1
N$112: A56.1 A56.2 IC12.8
N$113: A50.1 A50.2 IC12.2
N$114: A55.1 A55.2 IC12.7
N$115: A51.1 A51.2 IC12.3
N$116: A52.1 A52.2 IC12.4
N$117: A53.1 A53.2 IC12.5
N$118: A54.1 A54.2 IC12.6
N$119: A80.1 A80.2 IC13.16
N$120: A73.1 A73.2 IC13.9
N$121: A79.1 A79.2 IC13.15
N$122: A74.1 A74.2 IC13.10
N$123: A78.1 A78.2 IC13.14
N$124: A77.1 A77.2 IC13.13
N$125: A76.1 A76.2 IC13.12
N$126: A75.1 A75.2 IC13.11
N$127: A65.1 A65.2 IC13.1
N$128: A72.1 A72.2 IC13.8
N$129: A66.1 A66.2 IC13.2
N$130: A71.1 A71.2 IC13.7
N$131: A67.1 A67.2 IC13.3
N$132: A68.1 A68.2 IC13.4
N$133: A69.1 A69.2 IC13.5
N$134: A70.1 A70.2 IC13.6
N$135: A96.1 A96.2 IC14.16
N$136: A89.1 A89.2 IC14.9
N$137: A95.1 A95.2 IC14.15
N$138: A90.1 A90.2 IC14.10
N$139: A94.1 A94.2 IC14.14
N$140: A93.1 A93.2 IC14.13
N$141: A92.1 A92.2 IC14.12
N$142: A91.1 A91.2 IC14.11
N$143: A81.1 A81.2 IC14.1
N$144: A88.1 A88.2 IC14.8
N$145: A82.1 A82.2 IC14.2
N$146: A87.1 A87.2 IC14.7
N$147: A83.1 A83.2 IC14.3
N$148: A84.1 A84.2 IC14.4
N$149: A85.1 A85.2 IC14.5
N$150: A86.1 A86.2 IC14.6
N$151: A112.1 A112.2 IC15.16
N$152: A105.1 A105.2 IC15.9
N$153: A111.1 A111.2 IC15.15
N$154: A106.1 A106.2 IC15.10
N$155: A110.1 A110.2 IC15.14
N$156: A109.1 A109.2 IC15.13
N$157: A108.1 A108.2 IC15.12
N$158: A107.1 A107.2 IC15.11
N$159: A97.1 A97.2 IC15.1
N$160: A104.1 A104.2 IC15.8
N$161: A98.1 A98.2 IC15.2
N$162: A103.1 A103.2 IC15.7
N$163: A99.1 A99.2 IC15.3
N$164: A100.1 A100.2 IC15.4
N$165: A101.1 A101.2 IC15.5
N$166: A102.1 A102.2 IC15.6
N$167: A128.1 A128.2 IC16.16
N$168: A121.1 A121.2 IC16.9
N$169: A127.1 A127.2 IC16.15
N$170: A122.1 A122.2 IC16.10
N$171: A126.1 A126.2 IC16.14
N$172: A125.1 A125.2 IC16.13
N$173: A124.1 A124.2 IC16.12
N$174: A123.1 A123.2 IC16.11
N$175: A113.1 A113.2 IC16.1
N$176: A120.1 A120.2 IC16.8
N$177: A114.1 A114.2 IC16.2
N$178: A119.1 A119.2 IC16.7
N$179: A115.1 A115.2 IC16.3
N$180: A116.1 A116.2 IC16.4
N$181: A117.1 A117.2 IC16.5
N$182: A118.1 A118.2 IC16.6
N$183: A144.1 A144.2 IC17.16
N$184: A137.1 A137.2 IC17.9
N$185: A143.1 A143.2 IC17.15
N$186: A138.1 A138.2 IC17.10
N$187: A142.1 A142.2 IC17.14
N$188: A141.1 A141.2 IC17.13
N$189: A140.1 A140.2 IC17.12
N$190: A139.1 A139.2 IC17.11
N$191: A129.1 A129.2 IC17.1
N$192: A136.1 A136.2 IC17.8
N$193: A130.1 A130.2 IC17.2
N$194: A135.1 A135.2 IC17.7
N$195: A131.1 A131.2 IC17.3
N$196: A132.1 A132.2 IC17.4
N$197: A133.1 A133.2 IC17.5
N$198: A134.1 A134.2 IC17.6
N$199: A160.1 A160.2 IC18.16
N$200: A153.1 A153.2 IC18.9
N$201: A159.1 A159.2 IC18.15
N$202: A154.1 A154.2 IC18.10
N$203: A158.1 A158.2 IC18.14
N$204: A157.1 A157.2 IC18.13
N$205: A156.1 A156.2 IC18.12
N$206: A155.1 A155.2 IC18.11
N$207: A145.1 A145.2 IC18.1
N$208: A152.1 A152.2 IC18.8
N$209: A146.1 A146.2 IC18.2
N$210: A151.1 A151.2 IC18.7
N$211: A147.1 A147.2 IC18.3
N$212: A148.1 A148.2 IC18.4
N$213: A149.1 A149.2 IC18.5
N$214: A150.1 A150.2 IC18.6
N$215: A176.1 A176.2 IC19.16
N$216: A169.1 A169.2 IC19.9
N$217: A175.1 A175.2 IC19.15
N$218: A170.1 A170.2 IC19.10
N$219: A174.1 A174.2 IC19.14
N$220: A173.1 A173.2 IC19.13
N$221: A172.1 A172.2 IC19.12
N$222: A171.1 A171.2 IC19.11
N$223: A161.1 A161.2 IC19.1
N$224: A168.1 A168.2 IC19.8
N$225: A162.1 A162.2 IC19.2
N$226: A167.1 A167.2 IC19.7
N$227: A163.1 A163.2 IC19.3
N$228: A164.1 A164.2 IC19.4
N$229: A165.1 A165.2 IC19.5
N$230: A166.1 A166.2 IC19.6
N$231: A192.1 A192.2 IC20.16
N$232: A185.1 A185.2 IC20.9
N$233: A191.1 A191.2 IC20.15
N$234: A186.1 A186.2 IC20.10
N$235: A190.1 A190.2 IC20.14
N$236: A189.1 A189.2 IC20.13
N$237: A188.1 A188.2 IC20.12
N$238: A187.1 A187.2 IC20.11
N$239: A177.1 A177.2 IC20.1
N$240: A184.1 A184.2 IC20.8
N$241: A178.1 A178.2 IC20.2
N$242: A183.1 A183.2 IC20.7
N$243: A179.1 A179.2 IC20.3
N$244: A180.1 A180.2 IC20.4
N$245: A181.1 A181.2 IC20.5
N$246: A182.1 A182.2 IC20.6
N$479: A304.1 A304.2 IC27.16
N$480: A297.1 A297.2 IC27.9
N$481: A208.1 A208.2 IC21.16
N$482: A201.1 A201.2 IC21.9
N$483: A207.1 A207.2 IC21.15
N$484: A202.1 A202.2 IC21.10
N$485: A206.1 A206.2 IC21.14
N$486: A205.1 A205.2 IC21.13
N$487: A204.1 A204.2 IC21.12
N$488: A203.1 A203.2 IC21.11
N$489: A193.1 A193.2 IC21.1
N$490: A200.1 A200.2 IC21.8
N$491: A194.1 A194.2 IC21.2
N$492: A199.1 A199.2 IC21.7
N$493: A195.1 A195.2 IC21.3
N$494: A196.1 A196.2 IC21.4
N$495: A197.1 A197.2 IC21.5
N$496: A198.1 A198.2 IC21.6
N$497: A224.1 A224.2 IC22.16
N$498: A217.1 A217.2 IC22.9
N$499: A223.1 A223.2 IC22.15
N$500: A218.1 A218.2 IC22.10
N$501: A222.1 A222.2 IC22.14
N$502: A221.1 A221.2 IC22.13
N$503: A220.1 A220.2 IC22.12
N$504: A219.1 A219.2 IC22.11
N$505: A209.1 A209.2 IC22.1
N$506: A216.1 A216.2 IC22.8
N$507: A210.1 A210.2 IC22.2
N$508: A215.1 A215.2 IC22.7
N$509: A211.1 A211.2 IC22.3
N$510: A212.1 A212.2 IC22.4
N$511: A213.1 A213.2 IC22.5
N$512: A214.1 A214.2 IC22.6
N$513: A240.1 A240.2 IC23.16
N$514: A233.1 A233.2 IC23.9
N$515: A239.1 A239.2 IC23.15
N$516: A234.1 A234.2 IC23.10
N$517: A238.1 A238.2 IC23.14
N$518: A237.1 A237.2 IC23.13
N$519: A236.1 A236.2 IC23.12
N$520: A235.1 A235.2 IC23.11
N$521: A225.1 A225.2 IC23.1
N$522: A232.1 A232.2 IC23.8
N$523: A226.1 A226.2 IC23.2
N$524: A231.1 A231.2 IC23.7
N$525: A227.1 A227.2 IC23.3
N$526: A228.1 A228.2 IC23.4
N$527: A229.1 A229.2 IC23.5
N$528: A230.1 A230.2 IC23.6
N$529: A256.1 A256.2 IC24.16
N$530: A249.1 A249.2 IC24.9
N$531: A255.1 A255.2 IC24.15
N$532: A250.1 A250.2 IC24.10
N$533: A254.1 A254.2 IC24.14
N$534: A253.1 A253.2 IC24.13
N$535: A252.1 A252.2 IC24.12
N$536: A251.1 A251.2 IC24.11
N$537: A241.1 A241.2 IC24.1
N$538: A248.1 A248.2 IC24.8
N$539: A242.1 A242.2 IC24.2
N$540: A247.1 A247.2 IC24.7
N$541: A243.1 A243.2 IC24.3
N$542: A244.1 A244.2 IC24.4
N$543: A245.1 A245.2 IC24.5
N$544: A246.1 A246.2 IC24.6
N$545: A272.1 A272.2 IC25.16
N$546: A265.1 A265.2 IC25.9
N$547: A271.1 A271.2 IC25.15
N$548: A266.1 A266.2 IC25.10
N$549: A270.1 A270.2 IC25.14
N$550: A269.1 A269.2 IC25.13
N$551: A268.1 A268.2 IC25.12
N$552: A267.1 A267.2 IC25.11
N$553: A257.1 A257.2 IC25.1
N$554: A264.1 A264.2 IC25.8
N$555: A258.1 A258.2 IC25.2
N$556: A263.1 A263.2 IC25.7
N$557: A259.1 A259.2 IC25.3
N$558: A260.1 A260.2 IC25.4
N$559: A261.1 A261.2 IC25.5
N$560: A262.1 A262.2 IC25.6
N$561: A288.1 A288.2 IC26.16
N$562: A281.1 A281.2 IC26.9
N$563: A287.1 A287.2 IC26.15
N$564: A282.1 A282.2 IC26.10
N$565: A286.1 A286.2 IC26.14
N$566: A285.1 A285.2 IC26.13
N$567: A284.1 A284.2 IC26.12
N$568: A283.1 A283.2 IC26.11
N$569: A273.1 A273.2 IC26.1
N$570: A280.1 A280.2 IC26.8
N$571: A274.1 A274.2 IC26.2
N$572: A279.1 A279.2 IC26.7
N$573: A275.1 A275.2 IC26.3
N$574: A276.1 A276.2 IC26.4
N$575: A277.1 A277.2 IC26.5
N$576: A278.1 A278.2 IC26.6
N$577: A303.1 A303.2 IC27.15
N$578: A298.1 A298.2 IC27.10
N$579: A302.1 A302.2 IC27.14
N$580: A301.1 A301.2 IC27.13
N$581: A300.1 A300.2 IC27.12
N$582: A299.1 A299.2 IC27.11
N$583: A289.1 A289.2 IC27.1
N$584: A296.1 A296.2 IC27.8
N$585: A290.1 A290.2 IC27.2
N$586: A295.1 A295.2 IC27.7
N$587: A291.1 A291.2 IC27.3
N$588: A292.1 A292.2 IC27.4
N$589: A293.1 A293.2 IC27.5
N$590: A294.1 A294.2 IC27.6
N$591: A320.1 A320.2 IC28.16
N$592: A313.1 A313.2 IC28.9
N$593: A319.1 A319.2 IC28.15
N$594: A314.1 A314.2 IC28.10
N$595: A318.1 A318.2 IC28.14
N$596: A317.1 A317.2 IC28.13
N$597: A316.1 A316.2 IC28.12
N$598: A315.1 A315.2 IC28.11
N$599: A305.1 A305.2 IC28.1
N$600: A312.1 A312.2 IC28.8
N$601: A306.1 A306.2 IC28.2
N$602: A311.1 A311.2 IC28.7
N$603: A307.1 A307.2 IC28.3
N$604: A308.1 A308.2 IC28.4
N$605: A309.1 A309.2 IC28.5
N$606: A310.1 A310.2 IC28.6
N$607: A336.1 A336.2 IC29.16
N$608: A329.1 A329.2 IC29.9
N$609: A335.1 A335.2 IC29.15
N$610: A330.1 A330.2 IC29.10
N$611: A334.1 A334.2 IC29.14
N$612: A333.1 A333.2 IC29.13
N$613: A332.1 A332.2 IC29.12
N$614: A331.1 A331.2 IC29.11
N$615: A321.1 A321.2 IC29.1
N$616: A328.1 A328.2 IC29.8
N$617: A322.1 A322.2 IC29.2
N$618: A327.1 A327.2 IC29.7
N$619: A323.1 A323.2 IC29.3
N$620: A324.1 A324.2 IC29.4
N$621: A325.1 A325.2 IC29.5
N$622: A326.1 A326.2 IC29.6
N$623: A352.1 A352.2 IC30.16
N$624: A345.1 A345.2 IC30.9
N$625: A351.1 A351.2 IC30.15
N$626: A346.1 A346.2 IC30.10
N$627: A350.1 A350.2 IC30.14
N$628: A349.1 A349.2 IC30.13
N$629: A348.1 A348.2 IC30.12
N$630: A347.1 A347.2 IC30.11
N$631: A337.1 A337.2 IC30.1
N$632: A344.1 A344.2 IC30.8
N$633: A338.1 A338.2 IC30.2
N$634: A343.1 A343.2 IC30.7
N$635: A339.1 A339.2 IC30.3
N$636: A340.1 A340.2 IC30.4
N$637: A341.1 A341.2 IC30.5
N$638: A342.1 A342.2 IC30.6
N$639: A368.1 A368.2 IC31.16
N$640: A361.1 A361.2 IC31.9
N$641: A367.1 A367.2 IC31.15
N$642: A362.1 A362.2 IC31.10
N$643: A366.1 A366.2 IC31.14
N$644: A365.1 A365.2 IC31.13
N$645: A364.1 A364.2 IC31.12
N$646: A363.1 A363.2 IC31.11
N$647: A353.1 A353.2 IC31.1
N$648: A360.1 A360.2 IC31.8
N$649: A354.1 A354.2 IC31.2
N$650: A359.1 A359.2 IC31.7
N$651: A355.1 A355.2 IC31.3
N$652: A356.1 A356.2 IC31.4
N$653: A357.1 A357.2 IC31.5
N$654: A358.1 A358.2 IC31.6
N$715: A384.1 A384.2 IC32.16
N$716: A377.1 A377.2 IC32.9
N$717: A383.1 A383.2 IC32.15
N$718: A378.1 A378.2 IC32.10
N$719: A382.1 A382.2 IC32.14
N$720: A381.1 A381.2 IC32.13
N$721: A380.1 A380.2 IC32.12
N$722: A379.1 A379.2 IC32.11
N$723: A369.1 A369.2 IC32.1
N$724: A376.1 A376.2 IC32.8
N$725: A370.1 A370.2 IC32.2
N$726: A375.1 A375.2 IC32.7
N$727: A371.1 A371.2 IC32.3
N$728: A372.1 A372.2 IC32.4
N$729: A373.1 A373.2 IC32.5
N$730: A374.1 A374.2 IC32.6
N$731: A400.1 A400.2 IC33.16
N$732: A393.1 A393.2 IC33.9
N$733: A399.1 A399.2 IC33.15
N$734: A394.1 A394.2 IC33.10
N$735: A398.1 A398.2 IC33.14
N$736: A397.1 A397.2 IC33.13
N$737: A396.1 A396.2 IC33.12
N$738: A395.1 A395.2 IC33.11
N$739: A385.1 A385.2 IC33.1
N$740: A392.1 A392.2 IC33.8
N$741: A386.1 A386.2 IC33.2
N$742: A391.1 A391.2 IC33.7
N$743: A387.1 A387.2 IC33.3
N$744: A388.1 A388.2 IC33.4
N$745: A389.1 A389.2 IC33.5
N$746: A390.1 A390.2 IC33.6
N$747: A416.1 A416.2 IC34.16
N$748: A409.1 A409.2 IC34.9
N$749: A415.1 A415.2 IC34.15
N$750: A410.1 A410.2 IC34.10
N$751: A414.1 A414.2 IC34.14
N$752: A413.1 A413.2 IC34.13
N$753: A412.1 A412.2 IC34.12
N$754: A411.1 A411.2 IC34.11
N$755: A401.1 A401.2 IC34.1
N$756: A408.1 A408.2 IC34.8
N$757: A402.1 A402.2 IC34.2
N$758: A407.1 A407.2 IC34.7
N$759: A403.1 A403.2 IC34.3
N$760: A404.1 A404.2 IC34.4
N$761: A405.1 A405.2 IC34.5
N$762: A406.1 A406.2 IC34.6
N$763: A432.1 A432.2 IC35.16
N$764: A425.1 A425.2 IC35.9
N$765: A431.1 A431.2 IC35.15
N$766: A426.1 A426.2 IC35.10
N$767: A430.1 A430.2 IC35.14
N$768: A429.1 A429.2 IC35.13
N$769: A428.1 A428.2 IC35.12
N$770: A427.1 A427.2 IC35.11
N$771: A417.1 A417.2 IC35.1
N$772: A424.1 A424.2 IC35.8
N$773: A418.1 A418.2 IC35.2
N$774: A423.1 A423.2 IC35.7
N$775: A419.1 A419.2 IC35.3
N$776: A420.1 A420.2 IC35.4
N$777: A421.1 A421.2 IC35.5
N$778: A422.1 A422.2 IC35.6
N$811: A448.1 A448.2 IC36.16
N$812: A441.1 A441.2 IC36.9
N$813: A447.1 A447.2 IC36.15
N$814: A442.1 A442.2 IC36.10
N$815: A446.1 A446.2 IC36.14
N$816: A445.1 A445.2 IC36.13
N$817: A444.1 A444.2 IC36.12
N$818: A443.1 A443.2 IC36.11
N$819: A433.1 A433.2 IC36.1
N$820: A440.1 A440.2 IC36.8
N$821: A434.1 A434.2 IC36.2
N$822: A439.1 A439.2 IC36.7
N$823: A435.1 A435.2 IC36.3
N$824: A436.1 A436.2 IC36.4
N$825: A437.1 A437.2 IC36.5
N$826: A438.1 A438.2 IC36.6
VCC [supply]: VCC1.1 VCC1.2 VCC2.1 VCC2.2 VCC3.1 VCC3.2 VCC4.1 VCC4.2 VCC5.1 VCC5.2 VCC6.1 VCC6.2 VCC7.1 VCC7.2 VCC8.1 VCC8.2 VCC9.1 VCC9.2 VCC10.1 VCC10.2 VCC11.1 VCC11.2 VCC12.1 VCC12.2 VCC13.1 VCC13.2 VCC14.1 VCC14.2 VCC15.1 VCC15.2 VCC16.1 VCC16.2 VCC17.1 VCC17.2 VCC18.1 VCC18.2 VCC19.1 VCC19.2 VCC20.1 VCC20.2 VCC21.1 VCC21.2 VCC22.1 VCC22.2 VCC23.1 VCC23.2 VCC24.1 VCC24.2 VCC25.1 VCC25.2 VCC26.1 VCC26.2 VCC27.1 VCC27.2 VCC28.1 VCC28.2 VCC29.1 VCC29.2 VCC30.1 VCC30.2 VCC31.1 VCC31.2 VCC32.1 VCC32.2 VCC33.1 VCC33.2 VCC34.1 VCC34.2 VCC35.1 VCC35.2 VCC36.1 VCC36.2 VCC37.1 VCC37.2 VCC38.1 VCC38.2 VCC39.1 VCC39.2 VCC40.1 VCC40.2 VCC41.1 VCC41.2 VCC42.1 VCC42.2 VCC43.1 VCC43.2 VCC44.1 VCC44.2 ; also sheet 1,2,5

### Notes on the sheet
- 16 Pin Socket Areas
- Douglas Electronics | 1